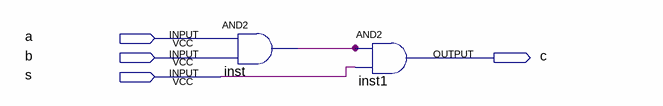
[diagram p0: schematic sheet]
// Quartus schematic and_gate_2.bdf as structural Verilog: 2 symbols, 4 pins
module and_gate_2 (
  input  a,
  input  b,
  input  s,
  output c
);

  wire inst_out;

  and inst (inst_out, a, b);
  and inst1 (c, inst_out, s);
endmodule
